# Altium schematic sheet RS232Tranceiver.SchDoc
size A4
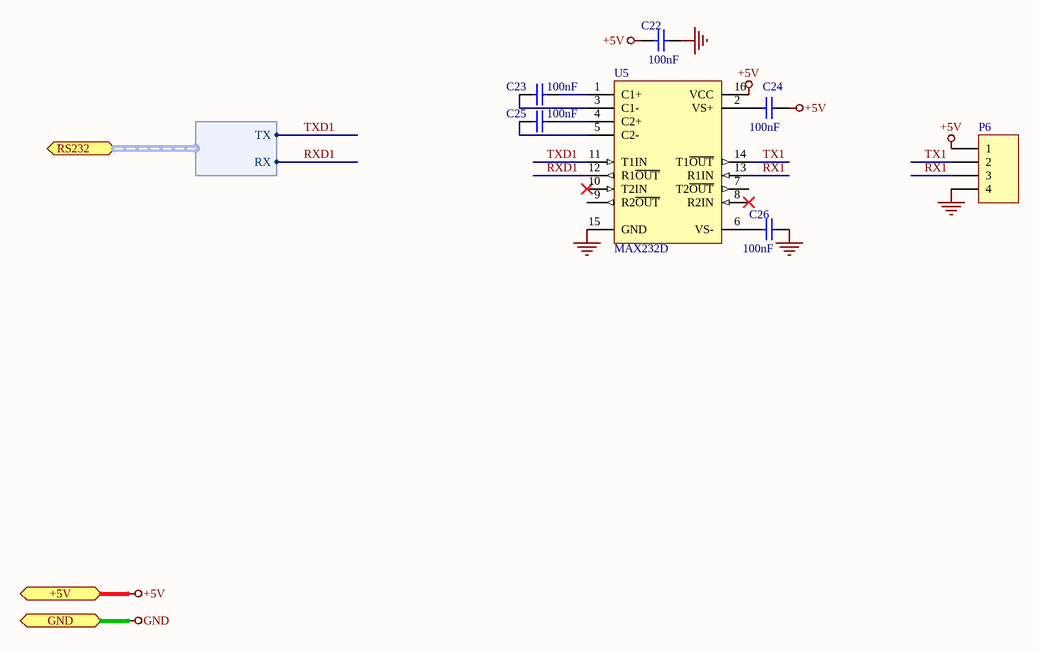
[diagram p0: RS232Tranceiver.SchDoc]

## Parts
C22  value 100nF  [C-0805]  (hidden comment: 104)
C23  value 100nF  [C-0805]  (hidden comment: 104)
C24  value 100nF  [C-0805]  (hidden comment: 104)
C25  value 100nF  [C-0805]  (hidden comment: 104)
C26  value 100nF  [C-0805]  (hidden comment: 104)
P6  XH2.54-4P  [CONN-XH2.54-4P]  (value not drawn)
U5  MAX232D  [SOIC-16]

## Ports
+5V, GND, RS232 (harness RS232)

## Harnesses
RS232: TX, RX

## Nets
+5V: C22.1 C24.1 P6.1 U5.16(VCC) ; port +5V
GND: C22.2 C26.2 P6.4 U5.15(GND) ; port GND
RX1: P6.3 U5.13(R1IN)
RXD1: U5.12(R1~{OUT}) ; port RS232.RX
TX1: P6.2 U5.14(T1~{OUT})
TXD1: U5.11(T1IN) ; port RS232.TX
NetC23_1: C23.1 U5.3(C1-)
NetC23_2: C23.2 U5.1(C1+)
NetC24_2: C24.2 U5.2(VS+)
NetC25_1: C25.1 U5.5(C2-)
NetC25_2: C25.2 U5.4(C2+)
NetC26_1: C26.1 U5.6(VS-)

Not connected (* = marked no-connect by the designer): U5 7(T2~{OUT}) 8(R2IN)* 9(R2~{OUT}) 10(T2IN)*

## Library data of the parts
C22-C26 = Cap: Capacitor; Published: 8-Jun-2000; LatestRevisionDate: 17-Jul-2002; LatestRevisionNote: Re-released for DXP Platform.; PackageReference: RAD-0.3; Publisher: Altium Limited
P6 = Header 4: Header, 4-Pin; Value: USART Connector; LatestRevisionDate: 17-Jul-2002; LatestRevisionNote: Re-released for DXP Platform.
U5 = MAX232D: Dual EIA-232 Driver/Receiver; Note: Receivers have typical hysteresis of 0.5V; Published: 15-May-2002; LatestRevisionDate: 13-Apr-2006; LatestRevisionNote: IPC-7351 Footprint Added.; DatasheetVersion: Jun-1989; PackageVersion: Jan-1998; PackageReference: D016; Publisher: Altium Limited; PackageDescription: 16-Pin Small Outline Integrated Circuit 1.27 mm Pitch; Code_IPC: SOIC127P600-16; ComponentLink1Description: Manufacturer Link; ComponentLink1URL: http://www.ti.com/; ComponentLink2Description: Datasheet; ComponentLink2URL: http://www-s.ti.com/sc/ds/max232.pdf